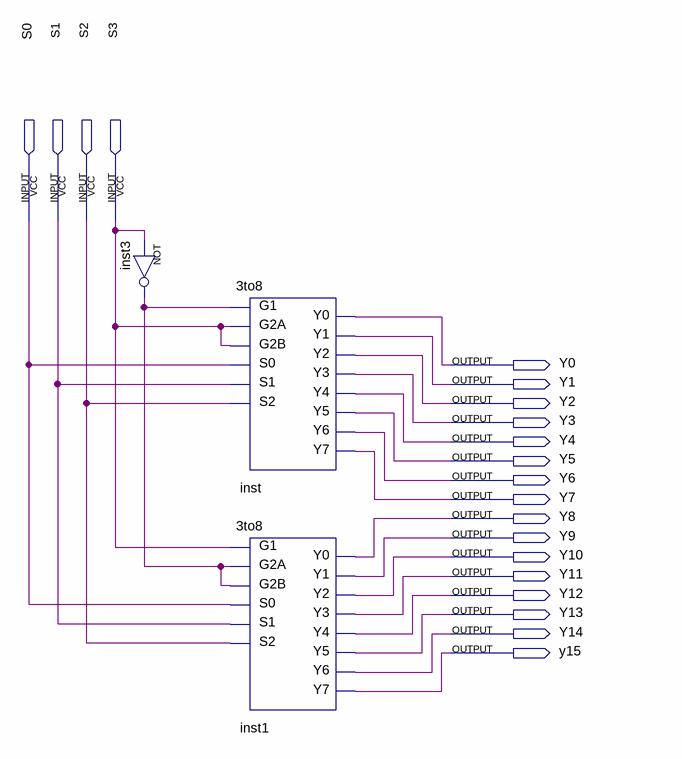
[diagram p0: schematic sheet]
// Quartus schematic 4to16.bdf as structural Verilog: 3 symbols, 20 pins
module \4to16  (
  input  S0,
  input  S1,
  input  S2,
  input  S3,
  output Y0,
  output Y1,
  output Y2,
  output Y3,
  output Y4,
  output Y5,
  output Y6,
  output Y7,
  output Y8,
  output Y9,
  output Y10,
  output Y11,
  output Y12,
  output Y13,
  output Y14,
  output y15
);

  wire inst3_out;

  not inst3 (inst3_out, S3);
  \3to8  inst (
    .G1(inst3_out), .G2A(S3), .G2B(S3), .S0(S0), .S1(S1), .S2(S2), .Y1(Y1), .Y2(Y2), .Y3(Y3), .Y4(Y4),
    .Y0(Y0), .Y5(Y5), .Y6(Y6), .Y7(Y7));
  \3to8  inst1 (
    .G1(S3), .G2A(inst3_out), .G2B(inst3_out), .S0(S0), .S1(S1), .S2(S2), .Y1(Y9), .Y2(Y10), .Y3(Y11),
    .Y4(Y12), .Y0(Y8), .Y5(Y13), .Y6(Y14), .Y7(y15));
endmodule
